# Altium schematic sheet Sheet1.SchDoc
size A
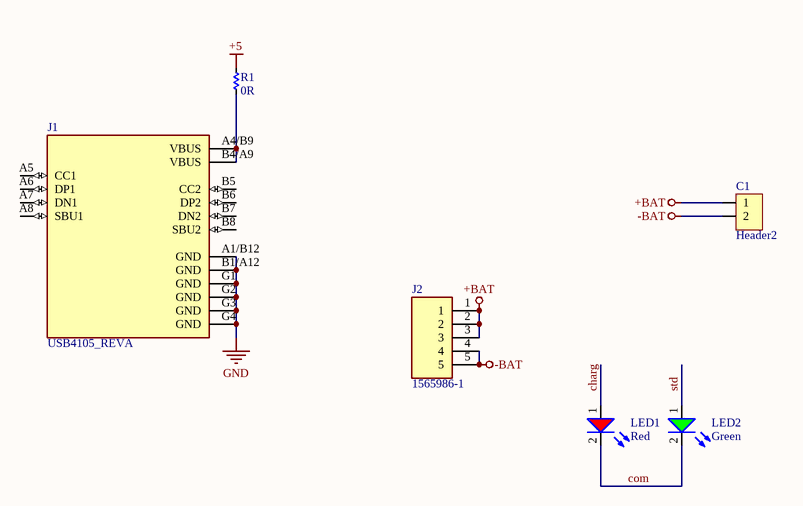
[diagram p0: Sheet1.SchDoc]

## Parts
C1  Header2  [Header2]
J1  USB4105_REVA  [GCT_USB4105_REVA]
J2  1565986-1  [TE_1565986-1]
LED1  value Red  [Led 0805R]  (hidden comment: LED-0805RVC)
LED2  value Green  [Led 0805G]  (hidden comment: LED-0805GVC)
R1  0R  [RES-SMD-0603]

## Nets
+5: R1.1
+BAT: C1.1 J2.1 J2.2 J2.3
-BAT: C1.2 J2.4 J2.5
GND: J1.A1/B12(GND) J1.B1/A12(GND) J1.G1(GND) J1.G2(GND) J1.G3(GND) J1.G4(GND)
charg: LED1.1(A)
com: LED1.2(K) LED2.2(K)
std: LED2.1(A)
NetJ1_A4/B9: J1.A4/B9(VBUS) J1.B4/A9(VBUS) R1.2

Not connected (* = marked no-connect by the designer): J1 A5(CC1) A6(DP1) A7(DN1) A8(SBU1) B5(CC2) B6(DP2) B7(DN2) B8(SBU2)

## Library data of the parts
C1 = Header2: Header IDC, 2 x 1 Pin Vertical 2.54mm Pitch (Non-Boxed, Male); Manufacturer: W¨¹rth Elektronik eiSos GmbH; partNo: 613002143121; ComponentLink1 Description: Manufacturer; ComponentLink2 Description: Datasheet; NoPins: 02; Created Date: 29 March 2013; ComponentLink1URL: http://www.we-online.com; ComponentLink2URL: http://katalog.we-online.de/em/datasheet/6130xx143121.pdf; Created by: Karrer Zheng
J1 = USB4105_REVA: USB-C _USB TYPE-C_ USB 2.0 Receptacle Connector 24 _16+8 Dummy_ Position Surface Mount, Right Angle; Through Hole; MF: Global Connector Technology; SnapEDA_Link: https://www.snapeda.com/parts/USB4105/Global%20Connector%20Technology/view-part/4223080/?ref=snap; Value: *; Price: None; Availability: Unavailable; MP: USB4105; Package: Package Analog Devices
J2 = 1565986-1: CONN RCPT 5POS 2.50MM PCB SLDR; Package: None; Price: None; Value: *; MP: 1565986-1; Availability: Unavailable
LED1 = LED-0805RVC: LED Red 2mA 1.8V 0805; ComponentLink1Description: Datasheet; ComponentLink1URL: D:\Dropbox\Datasheets\Opto and Illumination\LEDs\SMD LED.pdf; Unit Price: 0.0476
LED2 = LED-0805GVC: LED Green 2mA 3V 0805; ComponentLink1Description: Datasheet; ComponentLink1URL: D:\Dropbox\Datasheets\Opto and Illumination\LEDs\SMD LED.pdf; Unit Price: 0.0476
R1 = Res-SMD: Resistor; Manufacturer: Generic Components; Class: Passive; Published: 08/06/2000; Publisher: Altium Hobart Technology Centre